# EAGLE schematic lcd-i2c (EAGLE 6.1)
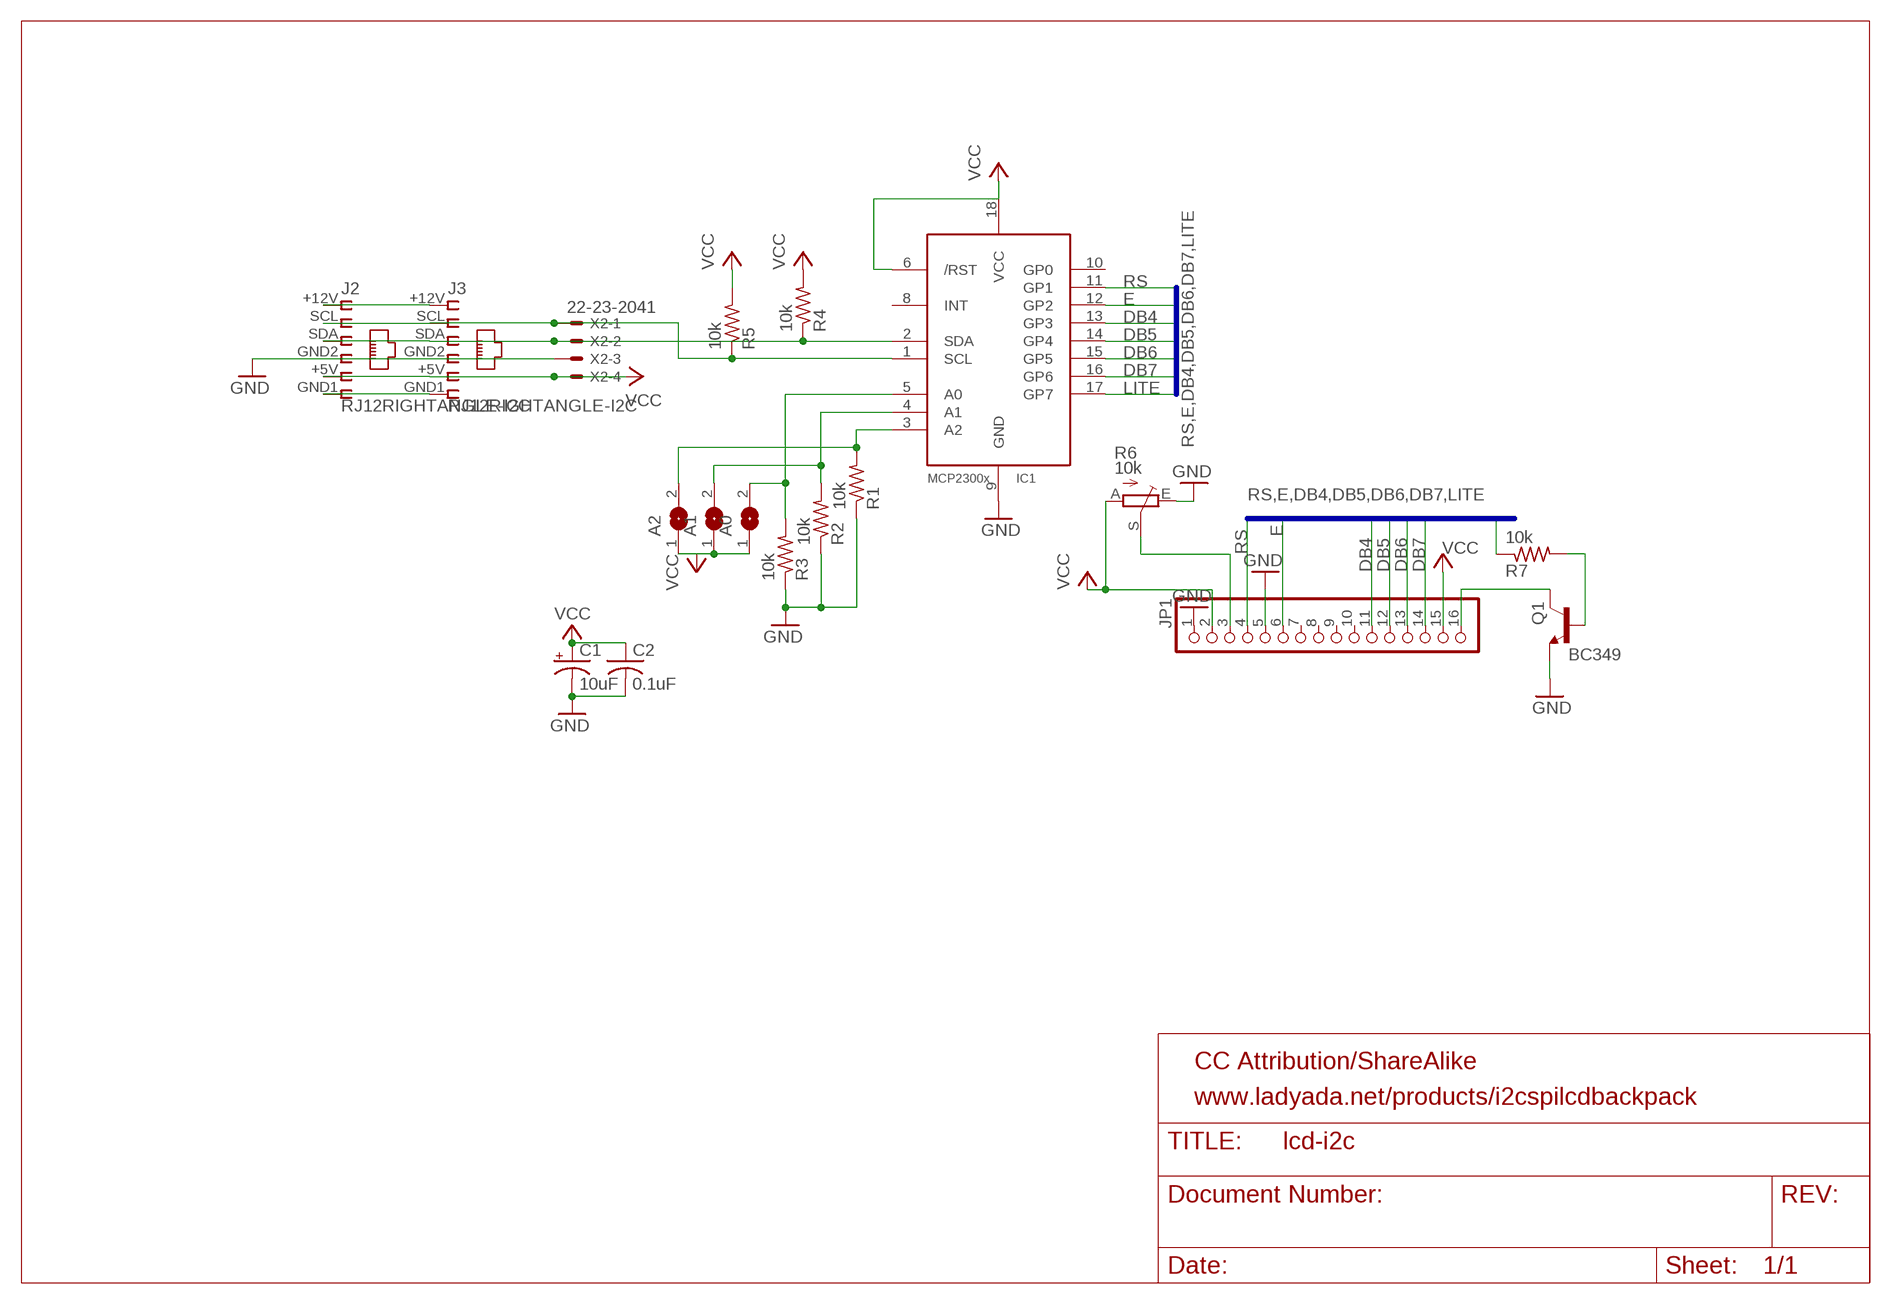
[diagram p0: schematic, sheet 1]

## Parts
A0  SJ  [SJ]
A1  SJ  [SJ]
A2  SJ  [SJ]
C1  10uF  CPOL-USA/3216-18R  [A/3216-18R]
C2  0.1uF  C-USC1206  [C1206]
IC1  MCP2300X/P  [DIL18]
J2  RJ12RIGHTANGLE-I2C  [RJ12-RIGHTANGLE-I2C]
J3  RJ12RIGHTANGLE-I2C  [RJ12-RIGHTANGLE-I2C]
JP1  PINHD-1X16  [1X16]
Q1  BC349  BC317-NPN-TO92-EBC  [TO92-EBC]
R1  10k  R-US_M1206  [M1206]
R2  10k  R-US_M1206  [M1206]
R3  10k  R-US_M1206  [M1206]
R4  10k  R-US_M1206  [M1206]
R5  10k  R-US_M1206  [M1206]
R6  10k  TRIM_EU-CA6V  [CA6V]
R7  10k  R-US_M1206  [M1206]
X2  22-23-2041  [22-23-2041]

## Nets
CLOCK: IC1.1(SCL) J2.SCL J3.SCL R5.1 X2.1
DATA: IC1.2(SDA) J2.SDA J3.SDA R4.1 X2.2
DB4: IC1.13(GP3) JP1.11
DB5: IC1.14(GP4) JP1.12
DB6: IC1.15(GP5) JP1.13
DB7: IC1.16(GP6) JP1.14
E: IC1.12(GP2) JP1.6
GND [power]: C1.- C2.2 IC1.9(GND) J2.GND2 J3.GND2 JP1.1 JP1.5 Q1.E R1.1 R2.1 R3.1 R6.E X2.3
LITE: IC1.17(GP7) R7.1
N$1: A0.2 IC1.5(A0) R3.2
N$2: A1.2 IC1.4(A1) R2.2
N$3: A2.2 IC1.3(A2) R1.2
N$4 [power]: J2.+12V J3.+12V
N$7: JP1.16 Q1.C
N$9: Q1.B R7.2
N$10: JP1.3 R6.S
N$11 [power]: J2.GND1 J3.GND1
RS: IC1.11(GP1) JP1.4
VCC [power]: A0.1 A1.1 A2.1 C1.+ C2.1 IC1.6(/RST) IC1.18(VCC) J2.+5V J3.+5V JP1.2 JP1.15 R4.2 R5.2 R6.A X2.4
Unconnected: IC1.8(INT) IC1.10(GP0) JP1.7 JP1.8 JP1.9 JP1.10

## Buses
RS,E,DB4,DB5,DB6,DB7,LITE

## Notes on the sheet
- CC Attribution/ShareAlike
- www.ladyada.net/products/i2cspilcdbackpack

## Library data of the parts
A0 A1 A2 = jumper:SJ: SMD solder JUMPER
C1 = adafruit:CPOL-US: POLARIZED CAPACITOR, American symbol
C2 = adafruit:C-US: CAPACITOR, American symbol
IC1 = adafruit:MCP2300X: MCP23008 Inexpensive i2c i/o expander - 8 general purpose i/o pins with optional pullups
J2 J3 = lpatiny:RJ12: CORCOM Modular RJ Jacks No Shield Source: www.tycoelectronics.com .. ENG_DS_1654001_1099_RJ_L_0507.pdf
JP1 = pinhead:PINHD-1X16: PIN HEADER
Q1 = transistor:*-NPN-: NPN Transistror BF959 corrected 2008.03.06
R1-R5 R7 = adafruit:R-US_: RESISTOR, American symbol
R6 = pot:TRIM_EU-: POTENTIOMETER
X2 = con-molex:22-23-2041: .100" (2.54mm) Center Header - 4 Pin; MF: MOLEX; MPN: 22-23-2041; OC_FARNELL: 1462920; OC_NEWARK: 38C0355

## Net classes
0 default: width 0.4 mm
1 power: width 0.8 mm